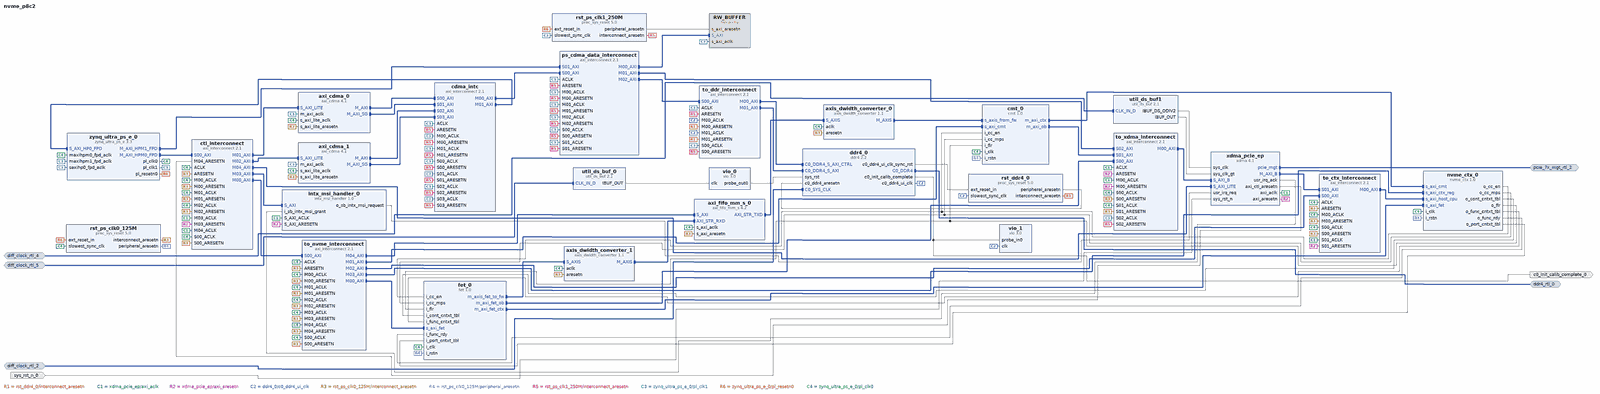
[diagram p0: block diagram of the top level, whole]
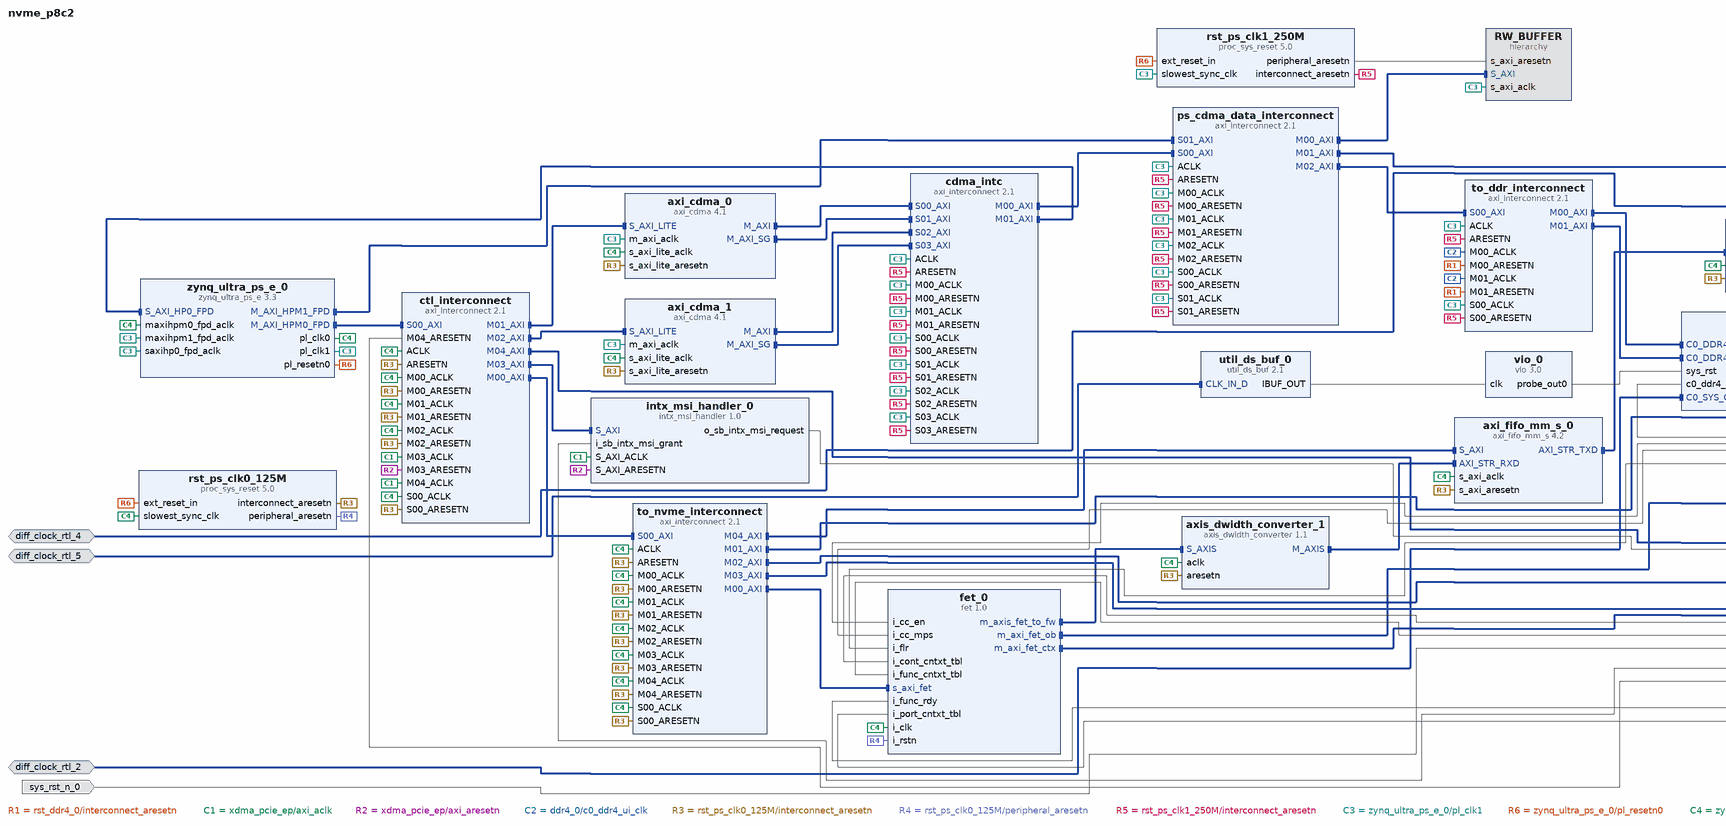
[diagram p1: block diagram of the top level, left part]
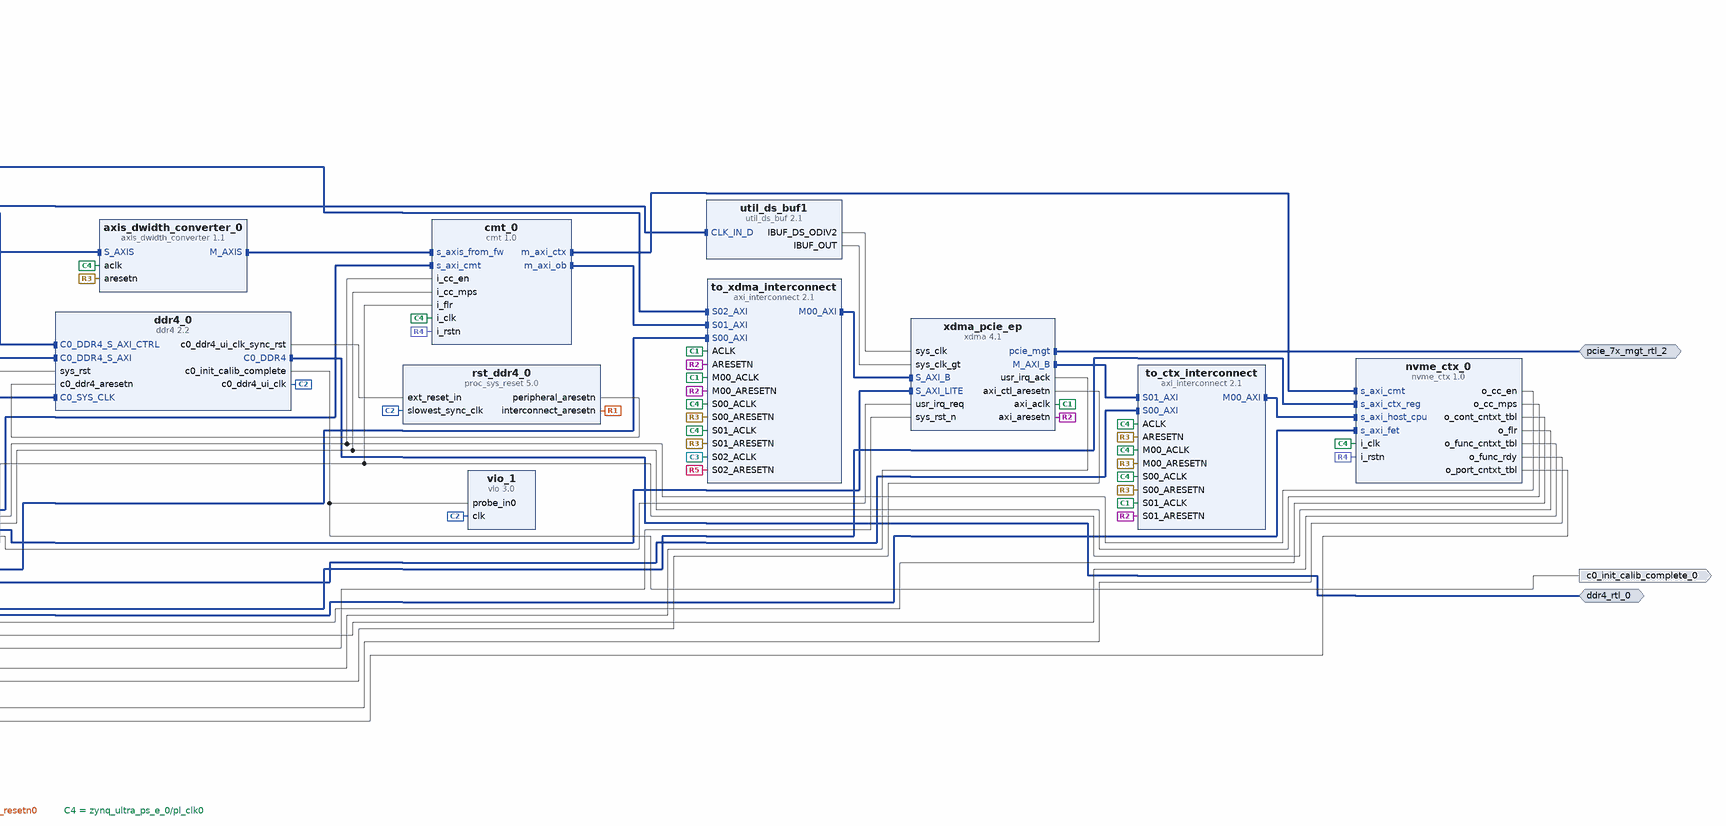
[diagram p2: block diagram of the top level, right part]
# Vivado block design nvme_p8c2, xczu17eg-ffvc1760-2-e, Vivado 2019.1
create_bd_design nvme_p8c2

create_bd_intf_port -mode Master -vlnv xilinx.com:interface:ddr4_rtl:1.0 ddr4_rtl_0
create_bd_intf_port -mode Slave -vlnv xilinx.com:interface:diff_clock_rtl:1.0 diff_clock_rtl_2
set_property -dict {CONFIG.FREQ_HZ 300000000} [get_bd_intf_ports diff_clock_rtl_2]
create_bd_intf_port -mode Slave -vlnv xilinx.com:interface:diff_clock_rtl:1.0 diff_clock_rtl_4
create_bd_intf_port -mode Slave -vlnv xilinx.com:interface:diff_clock_rtl:1.0 diff_clock_rtl_5
create_bd_intf_port -mode Master -vlnv xilinx.com:interface:pcie_7x_mgt_rtl:1.0 pcie_7x_mgt_rtl_2
create_bd_port -dir O c0_init_calib_complete_0
create_bd_port -dir I -type rst sys_rst_n_0

create_bd_cell -type hier RW_BUFFER
create_bd_cell -type ip -vlnv xilinx.com:ip:axi_cdma:4.1 axi_cdma_0
set_property -dict [list \
  CONFIG.C_ADDR_WIDTH 64 \
  CONFIG.C_INCLUDE_SF 1 \
  CONFIG.C_INCLUDE_SG 1 \
  CONFIG.C_M_AXI_DATA_WIDTH 256 \
  CONFIG.C_M_AXI_MAX_BURST_LEN 128 \
] [get_bd_cells axi_cdma_0]
create_bd_cell -type ip -vlnv xilinx.com:ip:axi_fifo_mm_s:4.2 axi_fifo_mm_s_0
set_property -dict [list \
  CONFIG.C_AXIS_TDEST_WIDTH 1 \
  CONFIG.C_HAS_AXIS_TDEST true \
  CONFIG.C_USE_TX_CTRL 0 \
] [get_bd_cells axi_fifo_mm_s_0]
create_bd_cell -type ip -vlnv xilinx.com:ip:axis_dwidth_converter:1.1 axis_dwidth_converter_0
set_property -dict {CONFIG.M_TDATA_NUM_BYTES 16 CONFIG.S_TDATA_NUM_BYTES 4} [get_bd_cells axis_dwidth_converter_0]
create_bd_cell -type ip -vlnv xilinx.com:ip:axis_dwidth_converter:1.1 axis_dwidth_converter_1
set_property -dict {CONFIG.M_TDATA_NUM_BYTES 4 CONFIG.S_TDATA_NUM_BYTES 64} [get_bd_cells axis_dwidth_converter_1]
create_bd_cell -type ip -vlnv xilinx.com:ip:axi_interconnect:2.1 cdma_intc
set_property -dict [list \
  CONFIG.ENABLE_ADVANCED_OPTIONS 1 \
  CONFIG.M00_HAS_DATA_FIFO 0 \
  CONFIG.M00_HAS_REGSLICE 3 \
  CONFIG.M01_HAS_DATA_FIFO 0 \
  CONFIG.M01_HAS_REGSLICE 3 \
  CONFIG.NUM_MI 2 \
  CONFIG.NUM_SI 4 \
  CONFIG.S00_HAS_DATA_FIFO 0 \
  CONFIG.S01_HAS_DATA_FIFO 0 \
  CONFIG.S02_HAS_DATA_FIFO 0 \
  CONFIG.S03_HAS_DATA_FIFO 0 \
  CONFIG.STRATEGY 0 \
  CONFIG.XBAR_DATA_WIDTH 256 \
] [get_bd_cells cdma_intc]
create_bd_cell -type ip -vlnv xilinx.com:user:cmt:1.0 cmt_0
create_bd_cell -type ip -vlnv xilinx.com:ip:ddr4:2.2 ddr4_0
set_property -dict [list \
  CONFIG.C0.CKE_WIDTH 4 \
  CONFIG.C0.CK_WIDTH 2 \
  CONFIG.C0.CS_WIDTH 4 \
  CONFIG.C0.DDR4_AxiAddressWidth 36 \
  CONFIG.C0.DDR4_AxiDataWidth 512 \
  CONFIG.C0.DDR4_CasLatency 12 \
  CONFIG.C0.DDR4_CasWriteLatency 11 \
  CONFIG.C0.DDR4_DataWidth 72 \
  CONFIG.C0.DDR4_InputClockPeriod 3334 \
  CONFIG.C0.DDR4_MemoryPart MTA36ASF4G72PZ-2G3 \
  CONFIG.C0.DDR4_MemoryType RDIMMs \
  CONFIG.C0.DDR4_Slot Dual \
  CONFIG.C0.DDR4_TimePeriod 1250 \
  CONFIG.C0.ODT_WIDTH 4 \
] [get_bd_cells ddr4_0]
create_bd_cell -type ip -vlnv xilinx.com:user:fet:1.0 fet_0
create_bd_cell -type ip -vlnv xilinx.com:user:intx_msi_handler:1.0 intx_msi_handler_0
create_bd_cell -type ip -vlnv xilinx.com:user:nvme_ctx:1.0 nvme_ctx_0
create_bd_cell -type ip -vlnv xilinx.com:ip:axi_interconnect:2.1 ps_cdma_data_interconnect
set_property -dict [list \
  CONFIG.ENABLE_ADVANCED_OPTIONS 1 \
  CONFIG.M00_HAS_DATA_FIFO 0 \
  CONFIG.M00_HAS_REGSLICE 0 \
  CONFIG.M01_HAS_REGSLICE 0 \
  CONFIG.M02_HAS_DATA_FIFO 0 \
  CONFIG.M02_HAS_REGSLICE 0 \
  CONFIG.M04_HAS_REGSLICE 0 \
  CONFIG.NUM_MI 3 \
  CONFIG.NUM_SI 2 \
  CONFIG.S00_HAS_DATA_FIFO 0 \
  CONFIG.S00_HAS_REGSLICE 0 \
  CONFIG.S01_HAS_DATA_FIFO 0 \
  CONFIG.S01_HAS_REGSLICE 0 \
  CONFIG.STRATEGY 0 \
  CONFIG.XBAR_DATA_WIDTH 256 \
] [get_bd_cells ps_cdma_data_interconnect]
create_bd_cell -type ip -vlnv xilinx.com:ip:proc_sys_reset:5.0 rst_ddr4_0
create_bd_cell -type ip -vlnv xilinx.com:ip:proc_sys_reset:5.0 rst_ps_clk1_250M
create_bd_cell -type ip -vlnv xilinx.com:ip:proc_sys_reset:5.0 rst_ps_clk0_125M
create_bd_cell -type ip -vlnv xilinx.com:ip:axi_interconnect:2.1 to_ctx_interconnect
set_property -dict [list \
  CONFIG.NUM_MI 1 \
  CONFIG.NUM_SI 2 \
  CONFIG.S00_HAS_DATA_FIFO 0 \
  CONFIG.S01_HAS_DATA_FIFO 0 \
  CONFIG.STRATEGY 0 \
] [get_bd_cells to_ctx_interconnect]
create_bd_cell -type ip -vlnv xilinx.com:ip:axi_interconnect:2.1 to_ddr_interconnect
set_property -dict [list \
  CONFIG.ENABLE_ADVANCED_OPTIONS 1 \
  CONFIG.M00_HAS_DATA_FIFO 0 \
  CONFIG.M00_HAS_REGSLICE 3 \
  CONFIG.M01_HAS_DATA_FIFO 0 \
  CONFIG.M01_HAS_REGSLICE 3 \
  CONFIG.M02_HAS_DATA_FIFO 0 \
  CONFIG.M02_HAS_REGSLICE 3 \
  CONFIG.M03_HAS_DATA_FIFO 0 \
  CONFIG.M03_HAS_REGSLICE 3 \
  CONFIG.NUM_MI 2 \
  CONFIG.NUM_SI 1 \
  CONFIG.S00_HAS_DATA_FIFO 0 \
  CONFIG.S00_HAS_REGSLICE 3 \
  CONFIG.STRATEGY 0 \
  CONFIG.XBAR_DATA_WIDTH 256 \
] [get_bd_cells to_ddr_interconnect]
create_bd_cell -type ip -vlnv xilinx.com:ip:axi_interconnect:2.1 to_nvme_interconnect
set_property -dict [list \
  CONFIG.ENABLE_ADVANCED_OPTIONS 1 \
  CONFIG.NUM_MI 5 \
  CONFIG.S00_HAS_DATA_FIFO 0 \
  CONFIG.STRATEGY 0 \
] [get_bd_cells to_nvme_interconnect]
create_bd_cell -type ip -vlnv xilinx.com:ip:axi_interconnect:2.1 to_xdma_interconnect
set_property -dict [list \
  CONFIG.ENABLE_ADVANCED_OPTIONS 1 \
  CONFIG.M00_HAS_REGSLICE 3 \
  CONFIG.NUM_MI 1 \
  CONFIG.NUM_SI 3 \
  CONFIG.S00_HAS_DATA_FIFO 0 \
  CONFIG.S01_HAS_DATA_FIFO 0 \
  CONFIG.S02_HAS_DATA_FIFO 0 \
  CONFIG.STRATEGY 0 \
  CONFIG.XBAR_DATA_WIDTH 256 \
] [get_bd_cells to_xdma_interconnect]
create_bd_cell -type ip -vlnv xilinx.com:ip:util_ds_buf:2.1 util_ds_buf1
set_property -dict {CONFIG.C_BUF_TYPE IBUFDSGTE} [get_bd_cells util_ds_buf1]
create_bd_cell -type ip -vlnv xilinx.com:ip:util_ds_buf:2.1 util_ds_buf_0
create_bd_cell -type ip -vlnv xilinx.com:ip:vio:3.0 vio_0
set_property -dict {CONFIG.C_NUM_PROBE_IN 0} [get_bd_cells vio_0]
create_bd_cell -type ip -vlnv xilinx.com:ip:vio:3.0 vio_1
set_property -dict {CONFIG.C_NUM_PROBE_OUT 0} [get_bd_cells vio_1]
create_bd_cell -type ip -vlnv xilinx.com:ip:xdma:4.1 xdma_pcie_ep
set_property -dict [list \
  CONFIG.PF0_DEVICE_ID_mqdma 9038 \
  CONFIG.PF2_DEVICE_ID_mqdma 9038 \
  CONFIG.PF3_DEVICE_ID_mqdma 9038 \
  CONFIG.axi_addr_width 64 \
  CONFIG.axi_data_width 256_bit \
  CONFIG.bar0_indicator 0 \
  CONFIG.c_m_axi_num_write 16 \
  CONFIG.en_dbg_descramble false \
  CONFIG.enable_ibert false \
  CONFIG.enable_jtag_dbg false \
  CONFIG.enable_mark_debug false \
  CONFIG.functional_mode AXI_Bridge \
  CONFIG.mode_selection Advanced \
  CONFIG.pcie_blk_locn X1Y0 \
  CONFIG.pciebar2axibar_0 0x00000004c0000000 \
  CONFIG.pf0_bar0_64bit true \
  CONFIG.pf0_bar0_size 16 \
  CONFIG.pf0_bar2_enabled false \
  CONFIG.pf0_base_class_menu Mass_storage_controller \
  CONFIG.pf0_class_code_base 01 \
  CONFIG.pf0_class_code_interface 02 \
  CONFIG.pf0_class_code_sub 08 \
  CONFIG.pf0_device_id a822 \
  CONFIG.pf0_msi_enabled false \
  CONFIG.pf0_msix_cap_pba_bir BAR_1:0 \
  CONFIG.pf0_msix_cap_pba_offset 3000 \
  CONFIG.pf0_msix_cap_table_bir BAR_1:0 \
  CONFIG.pf0_msix_cap_table_offset 00002000 \
  CONFIG.pf0_msix_cap_table_size 01F \
  CONFIG.pf0_msix_enabled true \
  CONFIG.pf0_msix_impl_locn External \
  CONFIG.pf0_sub_class_interface_menu Other_mass_storage_controller \
  CONFIG.pf0_subsystem_id 1fdf \
  CONFIG.pf0_subsystem_vendor_id 1028 \
  CONFIG.pl_link_cap_max_link_speed 8.0_GT/s \
  CONFIG.pl_link_cap_max_link_width X8 \
  CONFIG.plltype QPLL1 \
  CONFIG.vendor_id 144d \
] [get_bd_cells xdma_pcie_ep]
create_bd_cell -type ip -vlnv xilinx.com:ip:zynq_ultra_ps_e:3.3 zynq_ultra_ps_e_0
set_property -dict [list \
  CONFIG.CAN0_BOARD_INTERFACE custom \
  CONFIG.CAN1_BOARD_INTERFACE custom \
  CONFIG.CSU_BOARD_INTERFACE custom \
  CONFIG.DP_BOARD_INTERFACE custom \
  CONFIG.GEM0_BOARD_INTERFACE custom \
  CONFIG.GEM1_BOARD_INTERFACE custom \
  CONFIG.GEM2_BOARD_INTERFACE custom \
  CONFIG.GEM3_BOARD_INTERFACE custom \
  CONFIG.GPIO_BOARD_INTERFACE custom \
  CONFIG.IIC0_BOARD_INTERFACE custom \
  CONFIG.IIC1_BOARD_INTERFACE custom \
  CONFIG.NAND_BOARD_INTERFACE custom \
  CONFIG.PCIE_BOARD_INTERFACE custom \
  CONFIG.PJTAG_BOARD_INTERFACE custom \
  CONFIG.PMU_BOARD_INTERFACE custom \
  CONFIG.PSU_BANK_0_IO_STANDARD LVCMOS18 \
  CONFIG.PSU_BANK_1_IO_STANDARD LVCMOS18 \
  CONFIG.PSU_BANK_2_IO_STANDARD LVCMOS18 \
  CONFIG.PSU_BANK_3_IO_STANDARD LVCMOS33 \
  CONFIG.PSU_USB3__DUAL_CLOCK_ENABLE 0 \
  CONFIG.PSU__CAN1__PERIPHERAL__ENABLE 0 \
  CONFIG.PSU__CRF_APB__ACPU_CTRL__FREQMHZ 1333.333 \
  CONFIG.PSU__CRF_APB__ACPU_CTRL__SRCSEL APLL \
  CONFIG.PSU__CRF_APB__APLL_CTRL__SRCSEL PSS_REF_CLK \
  CONFIG.PSU__CRF_APB__DBG_FPD_CTRL__FREQMHZ 250 \
  CONFIG.PSU__CRF_APB__DBG_FPD_CTRL__SRCSEL IOPLL \
  CONFIG.PSU__CRF_APB__DBG_TRACE_CTRL__FREQMHZ 250 \
  CONFIG.PSU__CRF_APB__DBG_TRACE_CTRL__SRCSEL IOPLL \
  CONFIG.PSU__CRF_APB__DBG_TSTMP_CTRL__FREQMHZ 250 \
  CONFIG.PSU__CRF_APB__DBG_TSTMP_CTRL__SRCSEL IOPLL \
  CONFIG.PSU__CRF_APB__DDR_CTRL__FREQMHZ 1200 \
  CONFIG.PSU__CRF_APB__DDR_CTRL__SRCSEL DPLL \
  CONFIG.PSU__CRF_APB__DPDMA_REF_CTRL__FREQMHZ 600 \
  CONFIG.PSU__CRF_APB__DPDMA_REF_CTRL__SRCSEL DPLL \
  CONFIG.PSU__CRF_APB__DPLL_CTRL__SRCSEL PSS_REF_CLK \
  CONFIG.PSU__CRF_APB__DP_AUDIO_REF_CTRL__SRCSEL VPLL \
  CONFIG.PSU__CRF_APB__DP_STC_REF_CTRL__SRCSEL VPLL \
  CONFIG.PSU__CRF_APB__DP_VIDEO_REF_CTRL__SRCSEL DPLL \
  CONFIG.PSU__CRF_APB__GDMA_REF_CTRL__FREQMHZ 600 \
  CONFIG.PSU__CRF_APB__GDMA_REF_CTRL__SRCSEL DPLL \
  CONFIG.PSU__CRF_APB__GPU_REF_CTRL__FREQMHZ 600 \
  CONFIG.PSU__CRF_APB__GPU_REF_CTRL__SRCSEL DPLL \
  CONFIG.PSU__CRF_APB__TOPSW_LSBUS_CTRL__FREQMHZ 100 \
  CONFIG.PSU__CRF_APB__TOPSW_LSBUS_CTRL__SRCSEL IOPLL \
  CONFIG.PSU__CRF_APB__TOPSW_MAIN_CTRL__FREQMHZ 533.333 \
  CONFIG.PSU__CRF_APB__TOPSW_MAIN_CTRL__SRCSEL VPLL \
  CONFIG.PSU__CRF_APB__VPLL_CTRL__SRCSEL PSS_REF_CLK \
  CONFIG.PSU__CRL_APB__ADMA_REF_CTRL__FREQMHZ 533.333 \
  CONFIG.PSU__CRL_APB__ADMA_REF_CTRL__SRCSEL RPLL \
  CONFIG.PSU__CRL_APB__CAN1_REF_CTRL__FREQMHZ 100 \
  CONFIG.PSU__CRL_APB__CAN1_REF_CTRL__SRCSEL IOPLL \
  CONFIG.PSU__CRL_APB__CPU_R5_CTRL__FREQMHZ 533.333 \
  CONFIG.PSU__CRL_APB__CPU_R5_CTRL__SRCSEL RPLL \
  CONFIG.PSU__CRL_APB__DBG_LPD_CTRL__FREQMHZ 250 \
  CONFIG.PSU__CRL_APB__DBG_LPD_CTRL__SRCSEL IOPLL \
  CONFIG.PSU__CRL_APB__GEM3_REF_CTRL__FREQMHZ 125 \
  CONFIG.PSU__CRL_APB__GEM3_REF_CTRL__SRCSEL IOPLL \
  CONFIG.PSU__CRL_APB__I2C0_REF_CTRL__FREQMHZ 100 \
  CONFIG.PSU__CRL_APB__I2C0_REF_CTRL__SRCSEL IOPLL \
  CONFIG.PSU__CRL_APB__I2C1_REF_CTRL__FREQMHZ 100 \
  CONFIG.PSU__CRL_APB__I2C1_REF_CTRL__SRCSEL IOPLL \
  CONFIG.PSU__CRL_APB__IOPLL_CTRL__SRCSEL PSS_REF_CLK \
  CONFIG.PSU__CRL_APB__IOU_SWITCH_CTRL__FREQMHZ 267 \
  CONFIG.PSU__CRL_APB__IOU_SWITCH_CTRL__SRCSEL RPLL \
  CONFIG.PSU__CRL_APB__LPD_LSBUS_CTRL__FREQMHZ 100 \
  CONFIG.PSU__CRL_APB__LPD_LSBUS_CTRL__SRCSEL IOPLL \
  CONFIG.PSU__CRL_APB__LPD_SWITCH_CTRL__FREQMHZ 533.333 \
  CONFIG.PSU__CRL_APB__LPD_SWITCH_CTRL__SRCSEL RPLL \
  CONFIG.PSU__CRL_APB__PCAP_CTRL__FREQMHZ 200 \
  CONFIG.PSU__CRL_APB__PCAP_CTRL__SRCSEL IOPLL \
  CONFIG.PSU__CRL_APB__PL0_REF_CTRL__FREQMHZ 125 \
  CONFIG.PSU__CRL_APB__PL0_REF_CTRL__SRCSEL IOPLL \
  CONFIG.PSU__CRL_APB__PL1_REF_CTRL__FREQMHZ 250 \
  CONFIG.PSU__CRL_APB__PL1_REF_CTRL__SRCSEL IOPLL \
  CONFIG.PSU__CRL_APB__QSPI_REF_CTRL__FREQMHZ 300 \
  CONFIG.PSU__CRL_APB__QSPI_REF_CTRL__SRCSEL IOPLL \
  CONFIG.PSU__CRL_APB__RPLL_CTRL__SRCSEL PSS_REF_CLK \
  CONFIG.PSU__CRL_APB__SDIO1_REF_CTRL__FREQMHZ 50 \
  CONFIG.PSU__CRL_APB__SDIO1_REF_CTRL__SRCSEL IOPLL \
  CONFIG.PSU__CRL_APB__TIMESTAMP_REF_CTRL__FREQMHZ 100 \
  CONFIG.PSU__CRL_APB__TIMESTAMP_REF_CTRL__SRCSEL PSS_REF_CLK \
  CONFIG.PSU__CRL_APB__UART0_REF_CTRL__FREQMHZ 100 \
  CONFIG.PSU__CRL_APB__UART0_REF_CTRL__SRCSEL IOPLL \
  CONFIG.PSU__CRL_APB__UART1_REF_CTRL__FREQMHZ 100 \
  CONFIG.PSU__CRL_APB__UART1_REF_CTRL__SRCSEL IOPLL \
  CONFIG.PSU__CRL_APB__USB0_BUS_REF_CTRL__FREQMHZ 250 \
  CONFIG.PSU__CRL_APB__USB0_BUS_REF_CTRL__SRCSEL IOPLL \
  CONFIG.PSU__CRL_APB__USB3_DUAL_REF_CTRL__FREQMHZ 20 \
  CONFIG.PSU__CRL_APB__USB3_DUAL_REF_CTRL__SRCSEL IOPLL \
  CONFIG.PSU__CRL_APB__USB3__ENABLE 0 \
  CONFIG.PSU__CSUPMU__PERIPHERAL__VALID 1 \
  CONFIG.PSU__DDRC__BUS_WIDTH {32 Bit} \
  CONFIG.PSU__DDRC__DEVICE_CAPACITY {16384 MBits} \
  CONFIG.PSU__DDRC__DRAM_WIDTH {32 Bits} \
  CONFIG.PSU__DDRC__ECC Disabled \
  CONFIG.PSU__DDRC__MEMORY_TYPE {LPDDR 4} \
  CONFIG.PSU__DDRC__SPEED_BIN LPDDR4_2400 \
  CONFIG.PSU__DDR_HIGH_ADDRESS_GUI_ENABLE 0 \
  CONFIG.PSU__DDR__INTERFACE__FREQMHZ 600.000 \
  CONFIG.PSU__DEVICE_TYPE EG \
  CONFIG.PSU__DISPLAYPORT__PERIPHERAL__ENABLE 0 \
  CONFIG.PSU__DLL__ISUSED 1 \
  CONFIG.PSU__ENET3__FIFO__ENABLE 0 \
  CONFIG.PSU__ENET3__GRP_MDIO__ENABLE 1 \
  CONFIG.PSU__ENET3__GRP_MDIO__IO {MIO 76 .. 77} \
  CONFIG.PSU__ENET3__PERIPHERAL__ENABLE 1 \
  CONFIG.PSU__ENET3__PERIPHERAL__IO {MIO 64 .. 75} \
  CONFIG.PSU__ENET3__PTP__ENABLE 0 \
  CONFIG.PSU__ENET3__TSU__ENABLE 0 \
  CONFIG.PSU__EXPAND__FPD_SLAVES 1 \
  CONFIG.PSU__FPGA_PL0_ENABLE 1 \
  CONFIG.PSU__FPGA_PL1_ENABLE 1 \
  CONFIG.PSU__GEM3_COHERENCY 0 \
  CONFIG.PSU__GEM3_ROUTE_THROUGH_FPD 0 \
  CONFIG.PSU__GEM__TSU__ENABLE 0 \
  CONFIG.PSU__GPIO0_MIO__IO {MIO 0 .. 25} \
  CONFIG.PSU__GPIO0_MIO__PERIPHERAL__ENABLE 1 \
  CONFIG.PSU__GPIO1_MIO__IO {MIO 26 .. 51} \
  CONFIG.PSU__GPIO1_MIO__PERIPHERAL__ENABLE 1 \
  CONFIG.PSU__I2C0__PERIPHERAL__ENABLE 1 \
  CONFIG.PSU__I2C0__PERIPHERAL__IO {MIO 14 .. 15} \
  CONFIG.PSU__I2C1__PERIPHERAL__ENABLE 1 \
  CONFIG.PSU__I2C1__PERIPHERAL__IO {MIO 16 .. 17} \
  CONFIG.PSU__IOU_SLCR__IOU_TTC_APB_CLK__TTC0_SEL APB \
  CONFIG.PSU__IOU_SLCR__IOU_TTC_APB_CLK__TTC1_SEL APB \
  CONFIG.PSU__IOU_SLCR__IOU_TTC_APB_CLK__TTC2_SEL APB \
  CONFIG.PSU__IOU_SLCR__IOU_TTC_APB_CLK__TTC3_SEL APB \
  CONFIG.PSU__MAXIGP0__DATA_WIDTH 32 \
  CONFIG.PSU__OVERRIDE_HPX_QOS 0 \
  CONFIG.PSU__OVERRIDE__BASIC_CLOCK 0 \
  CONFIG.PSU__PMU_COHERENCY 0 \
  CONFIG.PSU__PMU__AIBACK__ENABLE 0 \
  CONFIG.PSU__PMU__EMIO_GPI__ENABLE 0 \
  CONFIG.PSU__PMU__EMIO_GPO__ENABLE 0 \
  CONFIG.PSU__PMU__GPI0__ENABLE 0 \
  CONFIG.PSU__PMU__GPI1__ENABLE 0 \
  CONFIG.PSU__PMU__GPI2__ENABLE 0 \
  CONFIG.PSU__PMU__GPI3__ENABLE 0 \
  CONFIG.PSU__PMU__GPI4__ENABLE 0 \
  CONFIG.PSU__PMU__GPI5__ENABLE 0 \
  CONFIG.PSU__PMU__GPO0__ENABLE 0 \
  CONFIG.PSU__PMU__GPO1__ENABLE 0 \
  CONFIG.PSU__PMU__GPO2__ENABLE 0 \
  CONFIG.PSU__PMU__GPO3__ENABLE 0 \
  CONFIG.PSU__PMU__GPO4__ENABLE 0 \
  CONFIG.PSU__PMU__GPO5__ENABLE 0 \
  CONFIG.PSU__PMU__PERIPHERAL__ENABLE 1 \
  CONFIG.PSU__PMU__PLERROR__ENABLE 0 \
  CONFIG.PSU__PRESET_APPLIED 0 \
  CONFIG.PSU__PSS_REF_CLK__FREQMHZ 33.333 \
  CONFIG.PSU__QSPI_COHERENCY 0 \
  CONFIG.PSU__QSPI_ROUTE_THROUGH_FPD 0 \
  CONFIG.PSU__QSPI__GRP_FBCLK__ENABLE 0 \
  CONFIG.PSU__QSPI__PERIPHERAL__DATA_MODE x4 \
  CONFIG.PSU__QSPI__PERIPHERAL__ENABLE 1 \
  CONFIG.PSU__QSPI__PERIPHERAL__IO {MIO 0 .. 12} \
  CONFIG.PSU__QSPI__PERIPHERAL__MODE {Dual Parallel} \
  CONFIG.PSU__SATA__PERIPHERAL__ENABLE 0 \
  CONFIG.PSU__SD1_COHERENCY 0 \
  CONFIG.PSU__SD1_ROUTE_THROUGH_FPD 0 \
  CONFIG.PSU__SD1__DATA_TRANSFER_MODE 4Bit \
  CONFIG.PSU__SD1__GRP_CD__ENABLE 1 \
  CONFIG.PSU__SD1__GRP_CD__IO {MIO 45} \
  CONFIG.PSU__SD1__GRP_POW__ENABLE 0 \
  CONFIG.PSU__SD1__GRP_WP__ENABLE 0 \
  CONFIG.PSU__SD1__PERIPHERAL__ENABLE 1 \
  CONFIG.PSU__SD1__PERIPHERAL__IO {MIO 46 .. 51} \
  CONFIG.PSU__SD1__SLOT_TYPE {SD 2.0} \
  CONFIG.PSU__SWDT0__CLOCK__ENABLE 0 \
  CONFIG.PSU__SWDT0__PERIPHERAL__ENABLE 1 \
  CONFIG.PSU__SWDT0__RESET__ENABLE 0 \
  CONFIG.PSU__SWDT1__CLOCK__ENABLE 0 \
  CONFIG.PSU__SWDT1__PERIPHERAL__ENABLE 1 \
  CONFIG.PSU__SWDT1__RESET__ENABLE 0 \
  CONFIG.PSU__TSU__BUFG_PORT_PAIR 0 \
  CONFIG.PSU__TTC0__CLOCK__ENABLE 0 \
  CONFIG.PSU__TTC0__PERIPHERAL__ENABLE 1 \
  CONFIG.PSU__TTC0__WAVEOUT__ENABLE 0 \
  CONFIG.PSU__TTC1__CLOCK__ENABLE 0 \
  CONFIG.PSU__TTC1__PERIPHERAL__ENABLE 1 \
  CONFIG.PSU__TTC1__WAVEOUT__ENABLE 0 \
  CONFIG.PSU__TTC2__CLOCK__ENABLE 0 \
  CONFIG.PSU__TTC2__PERIPHERAL__ENABLE 1 \
  CONFIG.PSU__TTC2__WAVEOUT__ENABLE 0 \
  CONFIG.PSU__TTC3__CLOCK__ENABLE 0 \
  CONFIG.PSU__TTC3__PERIPHERAL__ENABLE 1 \
  CONFIG.PSU__TTC3__WAVEOUT__ENABLE 0 \
  CONFIG.PSU__UART0__BAUD_RATE 115200 \
  CONFIG.PSU__UART0__MODEM__ENABLE 0 \
  CONFIG.PSU__UART0__PERIPHERAL__ENABLE 1 \
  CONFIG.PSU__UART0__PERIPHERAL__IO {MIO 18 .. 19} \
  CONFIG.PSU__UART1__BAUD_RATE 115200 \
  CONFIG.PSU__UART1__MODEM__ENABLE 0 \
  CONFIG.PSU__UART1__PERIPHERAL__ENABLE 1 \
  CONFIG.PSU__UART1__PERIPHERAL__IO {MIO 20 .. 21} \
  CONFIG.PSU__USB0__PERIPHERAL__ENABLE 0 \
  CONFIG.PSU__USE__IRQ0 0 \
  CONFIG.PSU__USE__M_AXI_GP0 1 \
  CONFIG.PSU__USE__M_AXI_GP1 1 \
  CONFIG.PSU__USE__M_AXI_GP2 0 \
  CONFIG.PSU__USE__S_AXI_GP2 1 \
  CONFIG.QSPI_BOARD_INTERFACE custom \
  CONFIG.SATA_BOARD_INTERFACE custom \
  CONFIG.SD0_BOARD_INTERFACE custom \
  CONFIG.SD1_BOARD_INTERFACE custom \
  CONFIG.SPI0_BOARD_INTERFACE custom \
  CONFIG.SPI1_BOARD_INTERFACE custom \
  CONFIG.SUBPRESET1 Custom \
  CONFIG.SUBPRESET2 Custom \
  CONFIG.SWDT0_BOARD_INTERFACE custom \
  CONFIG.SWDT1_BOARD_INTERFACE custom \
  CONFIG.TRACE_BOARD_INTERFACE custom \
  CONFIG.TTC0_BOARD_INTERFACE custom \
  CONFIG.TTC1_BOARD_INTERFACE custom \
  CONFIG.TTC2_BOARD_INTERFACE custom \
  CONFIG.TTC3_BOARD_INTERFACE custom \
  CONFIG.UART0_BOARD_INTERFACE custom \
  CONFIG.UART1_BOARD_INTERFACE custom \
  CONFIG.USB0_BOARD_INTERFACE custom \
  CONFIG.USB1_BOARD_INTERFACE custom \
] [get_bd_cells zynq_ultra_ps_e_0]
# 770 more settings of zynq_ultra_ps_e_0 are not shown: defaults, MIO pin electricals, DDR timing, and values the tool derives
create_bd_cell -type ip -vlnv xilinx.com:ip:axi_cdma:4.1 axi_cdma_1
set_property -dict [list \
  CONFIG.C_ADDR_WIDTH 64 \
  CONFIG.C_INCLUDE_SF 1 \
  CONFIG.C_M_AXI_DATA_WIDTH 256 \
  CONFIG.C_M_AXI_MAX_BURST_LEN 128 \
] [get_bd_cells axi_cdma_1]
create_bd_cell -type ip -vlnv xilinx.com:ip:axi_interconnect:2.1 ctl_interconnect
set_property -dict {CONFIG.NUM_MI 5} [get_bd_cells ctl_interconnect]

# ---- hierarchy /RW_BUFFER ----
current_bd_instance /RW_BUFFER
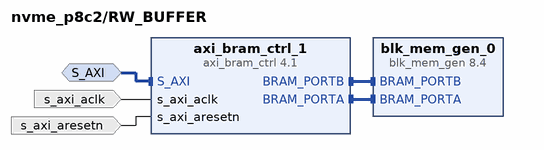
[diagram p3: block diagram inside /RW_BUFFER]
create_bd_intf_pin -mode Slave -vlnv xilinx.com:interface:aximm_rtl:1.0 S_AXI
create_bd_pin -dir I -type clk s_axi_aclk
create_bd_pin -dir I -type rst s_axi_aresetn

create_bd_cell -type ip -vlnv xilinx.com:ip:axi_bram_ctrl:4.1 axi_bram_ctrl_1
set_property -dict {CONFIG.DATA_WIDTH 256 CONFIG.RD_CMD_OPTIMIZATION 1} [get_bd_cells axi_bram_ctrl_1]
create_bd_cell -type ip -vlnv xilinx.com:ip:blk_mem_gen:8.4 blk_mem_gen_0
set_property -dict [list \
  CONFIG.Assume_Synchronous_Clk false \
  CONFIG.EN_SAFETY_CKT true \
  CONFIG.Enable_32bit_Address true \
  CONFIG.Enable_B Use_ENB_Pin \
  CONFIG.Memory_Type True_Dual_Port_RAM \
  CONFIG.Operating_Mode_A WRITE_FIRST \
  CONFIG.Operating_Mode_B WRITE_FIRST \
  CONFIG.PRIM_type_to_Implement BRAM \
  CONFIG.Port_B_Clock 100 \
  CONFIG.Port_B_Enable_Rate 100 \
  CONFIG.Port_B_Write_Rate 50 \
  CONFIG.Register_PortA_Output_of_Memory_Primitives false \
  CONFIG.Register_PortB_Output_of_Memory_Primitives false \
  CONFIG.Use_RSTA_Pin true \
  CONFIG.Use_RSTB_Pin true \
  CONFIG.use_bram_block BRAM_Controller \
] [get_bd_cells blk_mem_gen_0]

# ---- connections ----

current_bd_instance /RW_BUFFER
connect_bd_intf_net [get_bd_intf_pins axi_bram_ctrl_1/BRAM_PORTB] [get_bd_intf_pins blk_mem_gen_0/BRAM_PORTB]
connect_bd_intf_net [get_bd_intf_pins axi_bram_ctrl_1/BRAM_PORTA] [get_bd_intf_pins blk_mem_gen_0/BRAM_PORTA]
connect_bd_intf_net -intf_net axi_interconnect_4_M00_AXI [get_bd_intf_pins S_AXI] [get_bd_intf_pins axi_bram_ctrl_1/S_AXI]
connect_bd_net -net zynq_ultra_ps_e_0_pl_clk1 [get_bd_pins s_axi_aclk] [get_bd_pins axi_bram_ctrl_1/s_axi_aclk]
connect_bd_net -net proc_sys_reset_2_peripheral_aresetn [get_bd_pins s_axi_aresetn] [get_bd_pins axi_bram_ctrl_1/s_axi_aresetn]

current_bd_instance /
connect_bd_intf_net -intf_net axi_interconnect_4_M00_AXI1 [get_bd_intf_pins to_ctx_interconnect/M00_AXI] [get_bd_intf_pins nvme_ctx_0/s_axi_host_cpu]
connect_bd_intf_net [get_bd_intf_pins ctl_interconnect/S00_AXI] [get_bd_intf_pins zynq_ultra_ps_e_0/M_AXI_HPM0_FPD]
connect_bd_intf_net -intf_net axi_interconnect_0_M01_AXI [get_bd_intf_pins cdma_intc/M01_AXI] [get_bd_intf_pins zynq_ultra_ps_e_0/S_AXI_HP0_FPD]
connect_bd_intf_net -intf_net CLK_IN_D_0_1 [get_bd_intf_ports diff_clock_rtl_4] [get_bd_intf_pins util_ds_buf1/CLK_IN_D]
connect_bd_intf_net [get_bd_intf_pins to_ddr_interconnect/M00_AXI] [get_bd_intf_pins ddr4_0/C0_DDR4_S_AXI_CTRL]
connect_bd_intf_net -intf_net ps_ctl_interconnect_M04_AXI [get_bd_intf_pins xdma_pcie_ep/S_AXI_LITE] [get_bd_intf_pins ctl_interconnect/M04_AXI]
connect_bd_intf_net [get_bd_intf_pins cmt_0/m_axi_ob] [get_bd_intf_pins to_xdma_interconnect/S01_AXI]
connect_bd_intf_net [get_bd_intf_pins zynq_ultra_ps_e_0/M_AXI_HPM1_FPD] [get_bd_intf_pins ps_cdma_data_interconnect/S01_AXI]
connect_bd_intf_net -intf_net ps_ctl_interconnect_M02_AXI [get_bd_intf_pins ctl_interconnect/M02_AXI] [get_bd_intf_pins axi_cdma_1/S_AXI_LITE]
connect_bd_intf_net [get_bd_intf_ports ddr4_rtl_0] [get_bd_intf_pins ddr4_0/C0_DDR4]
connect_bd_intf_net [get_bd_intf_pins to_xdma_interconnect/S02_AXI] [get_bd_intf_pins ps_cdma_data_interconnect/M01_AXI]
connect_bd_intf_net [get_bd_intf_pins axi_fifo_mm_s_0/AXI_STR_TXD] [get_bd_intf_pins axis_dwidth_converter_0/S_AXIS]
connect_bd_intf_net [get_bd_intf_pins to_ctx_interconnect/S01_AXI] [get_bd_intf_pins xdma_pcie_ep/M_AXI_B]
connect_bd_intf_net [get_bd_intf_pins fet_0/m_axi_fet_ob] [get_bd_intf_pins to_xdma_interconnect/S00_AXI]
connect_bd_intf_net [get_bd_intf_pins cmt_0/m_axi_ctx] [get_bd_intf_pins nvme_ctx_0/s_axi_cmt]
connect_bd_intf_net [get_bd_intf_pins to_nvme_interconnect/S00_AXI] [get_bd_intf_pins ctl_interconnect/M00_AXI]
connect_bd_intf_net [get_bd_intf_pins axi_cdma_1/M_AXI] [get_bd_intf_pins cdma_intc/S02_AXI]
connect_bd_intf_net [get_bd_intf_pins to_nvme_interconnect/M02_AXI] [get_bd_intf_pins to_ctx_interconnect/S00_AXI]
connect_bd_intf_net [get_bd_intf_pins axi_cdma_0/M_AXI] [get_bd_intf_pins cdma_intc/S00_AXI]
connect_bd_intf_net -intf_net CLK_IN_D_0_2 [get_bd_intf_ports diff_clock_rtl_5] [get_bd_intf_pins util_ds_buf_0/CLK_IN_D]
connect_bd_intf_net [get_bd_intf_pins cmt_0/s_axi_cmt] [get_bd_intf_pins to_nvme_interconnect/M01_AXI]
connect_bd_intf_net -intf_net ps_ctl_interconnect_M01_AXI [get_bd_intf_pins ctl_interconnect/M01_AXI] [get_bd_intf_pins axi_cdma_0/S_AXI_LITE]
connect_bd_intf_net [get_bd_intf_pins to_nvme_interconnect/M04_AXI] [get_bd_intf_pins axi_fifo_mm_s_0/S_AXI]
connect_bd_intf_net -intf_net axi_interconnect_4_M00_AXI [get_bd_intf_pins ps_cdma_data_interconnect/M00_AXI] [get_bd_intf_pins RW_BUFFER/S_AXI]
connect_bd_intf_net -intf_net diff_clock_rtl_2_1 [get_bd_intf_ports diff_clock_rtl_2] [get_bd_intf_pins ddr4_0/C0_SYS_CLK]
connect_bd_intf_net [get_bd_intf_pins to_nvme_interconnect/M03_AXI] [get_bd_intf_pins nvme_ctx_0/s_axi_ctx_reg]
connect_bd_intf_net -intf_net xdma_2_pcie_mgt [get_bd_intf_ports pcie_7x_mgt_rtl_2] [get_bd_intf_pins xdma_pcie_ep/pcie_mgt]
connect_bd_intf_net [get_bd_intf_pins fet_0/m_axis_fet_to_fw] [get_bd_intf_pins axis_dwidth_converter_1/S_AXIS]
connect_bd_intf_net [get_bd_intf_pins axi_cdma_0/M_AXI_SG] [get_bd_intf_pins cdma_intc/S01_AXI]
connect_bd_intf_net -intf_net axi_interconnect_0_M00_AXI [get_bd_intf_pins cdma_intc/M00_AXI] [get_bd_intf_pins ps_cdma_data_interconnect/S00_AXI]
connect_bd_intf_net [get_bd_intf_pins axi_cdma_1/M_AXI_SG] [get_bd_intf_pins cdma_intc/S03_AXI]
connect_bd_intf_net [get_bd_intf_pins axis_dwidth_converter_1/M_AXIS] [get_bd_intf_pins axi_fifo_mm_s_0/AXI_STR_RXD]
connect_bd_intf_net [get_bd_intf_pins to_xdma_interconnect/M00_AXI] [get_bd_intf_pins xdma_pcie_ep/S_AXI_B]
connect_bd_intf_net -intf_net ps_ctl_interconnect_M03_AXI [get_bd_intf_pins intx_msi_handler_0/S_AXI] [get_bd_intf_pins ctl_interconnect/M03_AXI]
connect_bd_intf_net [get_bd_intf_pins cmt_0/s_axis_from_fw] [get_bd_intf_pins axis_dwidth_converter_0/M_AXIS]
connect_bd_intf_net [get_bd_intf_pins to_ddr_interconnect/S00_AXI] [get_bd_intf_pins ps_cdma_data_interconnect/M02_AXI]
connect_bd_intf_net [get_bd_intf_pins fet_0/m_axi_fet_ctx] [get_bd_intf_pins nvme_ctx_0/s_axi_fet]
connect_bd_intf_net [get_bd_intf_pins fet_0/s_axi_fet] [get_bd_intf_pins to_nvme_interconnect/M00_AXI]
connect_bd_intf_net [get_bd_intf_pins to_ddr_interconnect/M01_AXI] [get_bd_intf_pins ddr4_0/C0_DDR4_S_AXI]
connect_bd_net -net M00_ARESETN_1 [get_bd_pins rst_ddr4_0/interconnect_aresetn] \
  [get_bd_pins to_ddr_interconnect/M00_ARESETN] [get_bd_pins to_ddr_interconnect/M01_ARESETN]
connect_bd_net -net M06_ACLK_1 [get_bd_pins xdma_pcie_ep/axi_aclk] \
  [get_bd_pins intx_msi_handler_0/S_AXI_ACLK] [get_bd_pins to_xdma_interconnect/M00_ACLK] \
  [get_bd_pins to_ctx_interconnect/S01_ACLK] [get_bd_pins to_xdma_interconnect/ACLK] [get_bd_pins ctl_interconnect/M03_ACLK] \
  [get_bd_pins ctl_interconnect/M04_ACLK]
connect_bd_net -net M06_ARESETN_1 [get_bd_pins xdma_pcie_ep/axi_aresetn] \
  [get_bd_pins intx_msi_handler_0/S_AXI_ARESETN] [get_bd_pins to_xdma_interconnect/M00_ARESETN] \
  [get_bd_pins to_ctx_interconnect/S01_ARESETN] [get_bd_pins to_xdma_interconnect/ARESETN] \
  [get_bd_pins ctl_interconnect/M03_ARESETN]
connect_bd_net [get_bd_pins ddr4_0/c0_ddr4_ui_clk] \
  [get_bd_pins rst_ddr4_0/slowest_sync_clk] [get_bd_pins vio_1/clk] [get_bd_pins to_ddr_interconnect/M00_ACLK] \
  [get_bd_pins to_ddr_interconnect/M01_ACLK]
connect_bd_net [get_bd_pins ddr4_0/c0_ddr4_ui_clk_sync_rst] [get_bd_pins rst_ddr4_0/ext_reset_in]
connect_bd_net [get_bd_pins ddr4_0/c0_init_calib_complete] [get_bd_ports c0_init_calib_complete_0] [get_bd_pins vio_1/probe_in0]
connect_bd_net [get_bd_pins intx_msi_handler_0/o_sb_intx_msi_request] [get_bd_pins xdma_pcie_ep/usr_irq_req]
connect_bd_net [get_bd_pins nvme_ctx_0/o_cc_en] [get_bd_pins fet_0/i_cc_en] [get_bd_pins cmt_0/i_cc_en]
connect_bd_net [get_bd_pins nvme_ctx_0/o_cc_mps] [get_bd_pins cmt_0/i_cc_mps] [get_bd_pins fet_0/i_cc_mps]
connect_bd_net [get_bd_pins nvme_ctx_0/o_cont_cntxt_tbl] [get_bd_pins fet_0/i_cont_cntxt_tbl]
connect_bd_net [get_bd_pins nvme_ctx_0/o_flr] [get_bd_pins cmt_0/i_flr] [get_bd_pins fet_0/i_flr]
connect_bd_net [get_bd_pins nvme_ctx_0/o_func_cntxt_tbl] [get_bd_pins fet_0/i_func_cntxt_tbl]
connect_bd_net [get_bd_pins nvme_ctx_0/o_func_rdy] [get_bd_pins fet_0/i_func_rdy]
connect_bd_net [get_bd_pins nvme_ctx_0/o_port_cntxt_tbl] [get_bd_pins fet_0/i_port_cntxt_tbl]
connect_bd_net -net proc_sys_reset_2_peripheral_aresetn [get_bd_pins rst_ps_clk0_125M/interconnect_aresetn] \
  [get_bd_pins to_nvme_interconnect/M00_ARESETN] [get_bd_pins to_nvme_interconnect/M01_ARESETN] \
  [get_bd_pins to_nvme_interconnect/M02_ARESETN] [get_bd_pins to_nvme_interconnect/M03_ARESETN] \
  [get_bd_pins axi_fifo_mm_s_0/s_axi_aresetn] [get_bd_pins axis_dwidth_converter_0/aresetn] \
  [get_bd_pins axis_dwidth_converter_1/aresetn] [get_bd_pins to_ctx_interconnect/ARESETN] \
  [get_bd_pins to_ctx_interconnect/S00_ARESETN] [get_bd_pins to_ctx_interconnect/M00_ARESETN] \
  [get_bd_pins to_xdma_interconnect/S00_ARESETN] [get_bd_pins to_xdma_interconnect/S01_ARESETN] \
  [get_bd_pins to_nvme_interconnect/ARESETN] [get_bd_pins to_nvme_interconnect/S00_ARESETN] \
  [get_bd_pins to_nvme_interconnect/M04_ARESETN] [get_bd_pins ctl_interconnect/M02_ARESETN] \
  [get_bd_pins ctl_interconnect/M01_ARESETN] [get_bd_pins ctl_interconnect/M00_ARESETN] \
  [get_bd_pins ctl_interconnect/S00_ARESETN] [get_bd_pins ctl_interconnect/ARESETN] \
  [get_bd_pins axi_cdma_0/s_axi_lite_aresetn] [get_bd_pins axi_cdma_1/s_axi_lite_aresetn]
connect_bd_net -net rst_ddr4_0_333M_peripheral_aresetn [get_bd_pins rst_ddr4_0/peripheral_aresetn] [get_bd_pins ddr4_0/c0_ddr4_aresetn]
connect_bd_net -net rst_ps_clk1_peripheral_aresetn [get_bd_pins rst_ps_clk0_125M/peripheral_aresetn] \
  [get_bd_pins fet_0/i_rstn] [get_bd_pins cmt_0/i_rstn] [get_bd_pins nvme_ctx_0/i_rstn]
connect_bd_net -net rst_ps_clk2_250M_interconnect_aresetn [get_bd_pins rst_ps_clk1_250M/interconnect_aresetn] \
  [get_bd_pins ps_cdma_data_interconnect/ARESETN] [get_bd_pins ps_cdma_data_interconnect/S00_ARESETN] \
  [get_bd_pins ps_cdma_data_interconnect/S01_ARESETN] [get_bd_pins ps_cdma_data_interconnect/M00_ARESETN] \
  [get_bd_pins to_xdma_interconnect/S02_ARESETN] [get_bd_pins to_ddr_interconnect/ARESETN] \
  [get_bd_pins to_ddr_interconnect/S00_ARESETN] [get_bd_pins ps_cdma_data_interconnect/M01_ARESETN] \
  [get_bd_pins cdma_intc/ARESETN] [get_bd_pins cdma_intc/S00_ARESETN] [get_bd_pins cdma_intc/M00_ARESETN] \
  [get_bd_pins cdma_intc/M01_ARESETN] [get_bd_pins cdma_intc/S01_ARESETN] [get_bd_pins cdma_intc/S02_ARESETN] \
  [get_bd_pins cdma_intc/S03_ARESETN] [get_bd_pins ps_cdma_data_interconnect/M02_ARESETN]
connect_bd_net -net rst_ps_clk2_250M_peripheral_aresetn [get_bd_pins rst_ps_clk1_250M/peripheral_aresetn] [get_bd_pins RW_BUFFER/s_axi_aresetn]
connect_bd_net -net sys_rst_n_0_1 [get_bd_ports sys_rst_n_0] [get_bd_pins xdma_pcie_ep/sys_rst_n]
connect_bd_net [get_bd_pins util_ds_buf1/IBUF_DS_ODIV2] [get_bd_pins xdma_pcie_ep/sys_clk]
connect_bd_net [get_bd_pins util_ds_buf1/IBUF_OUT] [get_bd_pins xdma_pcie_ep/sys_clk_gt]
connect_bd_net [get_bd_pins util_ds_buf_0/IBUF_OUT] [get_bd_pins vio_0/clk]
connect_bd_net [get_bd_pins vio_0/probe_out0] [get_bd_pins ddr4_0/sys_rst]
connect_bd_net -net xdma_2_usr_irq_ack [get_bd_pins xdma_pcie_ep/usr_irq_ack] [get_bd_pins intx_msi_handler_0/i_sb_intx_msi_grant]
connect_bd_net [get_bd_pins zynq_ultra_ps_e_0/pl_clk1] \
  [get_bd_pins rst_ps_clk1_250M/slowest_sync_clk] [get_bd_pins axi_cdma_0/m_axi_aclk] \
  [get_bd_pins ps_cdma_data_interconnect/S00_ACLK] [get_bd_pins ps_cdma_data_interconnect/ACLK] \
  [get_bd_pins ps_cdma_data_interconnect/S01_ACLK] [get_bd_pins ps_cdma_data_interconnect/M00_ACLK] \
  [get_bd_pins RW_BUFFER/s_axi_aclk] [get_bd_pins to_xdma_interconnect/S02_ACLK] [get_bd_pins to_ddr_interconnect/S00_ACLK] \
  [get_bd_pins to_ddr_interconnect/ACLK] [get_bd_pins zynq_ultra_ps_e_0/saxihp0_fpd_aclk] [get_bd_pins cdma_intc/ACLK] \
  [get_bd_pins cdma_intc/S00_ACLK] [get_bd_pins cdma_intc/M00_ACLK] [get_bd_pins cdma_intc/M01_ACLK] \
  [get_bd_pins cdma_intc/S01_ACLK] [get_bd_pins axi_cdma_1/m_axi_aclk] [get_bd_pins cdma_intc/S02_ACLK] \
  [get_bd_pins cdma_intc/S03_ACLK] [get_bd_pins ps_cdma_data_interconnect/M01_ACLK] \
  [get_bd_pins ps_cdma_data_interconnect/M02_ACLK] [get_bd_pins zynq_ultra_ps_e_0/maxihpm1_fpd_aclk]
connect_bd_net [get_bd_pins zynq_ultra_ps_e_0/pl_resetn0] [get_bd_pins rst_ps_clk0_125M/ext_reset_in] [get_bd_pins rst_ps_clk1_250M/ext_reset_in]
connect_bd_net [get_bd_pins zynq_ultra_ps_e_0/pl_clk0] \
  [get_bd_pins ctl_interconnect/ACLK] [get_bd_pins rst_ps_clk0_125M/slowest_sync_clk] \
  [get_bd_pins to_nvme_interconnect/M00_ACLK] [get_bd_pins to_nvme_interconnect/M01_ACLK] \
  [get_bd_pins to_nvme_interconnect/M02_ACLK] [get_bd_pins to_nvme_interconnect/M03_ACLK] \
  [get_bd_pins axi_fifo_mm_s_0/s_axi_aclk] [get_bd_pins axis_dwidth_converter_0/aclk] \
  [get_bd_pins axis_dwidth_converter_1/aclk] [get_bd_pins fet_0/i_clk] [get_bd_pins cmt_0/i_clk] \
  [get_bd_pins nvme_ctx_0/i_clk] [get_bd_pins to_ctx_interconnect/ACLK] [get_bd_pins to_ctx_interconnect/S00_ACLK] \
  [get_bd_pins to_ctx_interconnect/M00_ACLK] [get_bd_pins to_xdma_interconnect/S00_ACLK] \
  [get_bd_pins to_xdma_interconnect/S01_ACLK] [get_bd_pins to_nvme_interconnect/ACLK] \
  [get_bd_pins to_nvme_interconnect/S00_ACLK] [get_bd_pins to_nvme_interconnect/M04_ACLK] \
  [get_bd_pins ctl_interconnect/S00_ACLK] [get_bd_pins ctl_interconnect/M00_ACLK] [get_bd_pins ctl_interconnect/M01_ACLK] \
  [get_bd_pins ctl_interconnect/M02_ACLK] [get_bd_pins axi_cdma_0/s_axi_lite_aclk] [get_bd_pins axi_cdma_1/s_axi_lite_aclk] \
  [get_bd_pins zynq_ultra_ps_e_0/maxihpm0_fpd_aclk]
connect_bd_net [get_bd_pins xdma_pcie_ep/axi_ctl_aresetn] [get_bd_pins ctl_interconnect/M04_ARESETN]

# ---- address map ----
assign_bd_address -offset 0x0000000000000000 -range 2G -target_address_space [get_bd_addr_spaces axi_cdma_0/Data] [get_bd_addr_segs zynq_ultra_ps_e_0/SAXIGP2/HP0_DDR_LOW]
assign_bd_address -offset 0x00000000B0000000 -range 32K -target_address_space [get_bd_addr_spaces axi_cdma_0/Data] [get_bd_addr_segs RW_BUFFER/axi_bram_ctrl_1/S_AXI/Mem0]
assign_bd_address -offset 0x0000005000000000 -range 64G -target_address_space [get_bd_addr_spaces axi_cdma_0/Data] [get_bd_addr_segs ddr4_0/C0_DDR4_MEMORY_MAP/C0_DDR4_ADDRESS_BLOCK]
assign_bd_address -offset 0x0000010000000000 -range 512G -target_address_space [get_bd_addr_spaces axi_cdma_0/Data] [get_bd_addr_segs xdma_pcie_ep/S_AXI_B/BAR0]
assign_bd_address -offset 0x0000000000000000 -range 2G -target_address_space [get_bd_addr_spaces axi_cdma_0/Data_SG] [get_bd_addr_segs zynq_ultra_ps_e_0/SAXIGP2/HP0_DDR_LOW]
assign_bd_address -offset 0x00000000B0000000 -range 32K -target_address_space [get_bd_addr_spaces axi_cdma_0/Data_SG] [get_bd_addr_segs RW_BUFFER/axi_bram_ctrl_1/S_AXI/Mem0]
assign_bd_address -offset 0x0000005000000000 -range 64G -target_address_space [get_bd_addr_spaces axi_cdma_0/Data_SG] [get_bd_addr_segs ddr4_0/C0_DDR4_MEMORY_MAP/C0_DDR4_ADDRESS_BLOCK]
assign_bd_address -offset 0x0000010000000000 -range 512G -target_address_space [get_bd_addr_spaces axi_cdma_0/Data_SG] [get_bd_addr_segs xdma_pcie_ep/S_AXI_B/BAR0]
assign_bd_address -offset 0x0000000000000000 -range 2G -target_address_space [get_bd_addr_spaces axi_cdma_1/Data] [get_bd_addr_segs zynq_ultra_ps_e_0/SAXIGP2/HP0_DDR_LOW]
assign_bd_address -offset 0x00000000B0000000 -range 32K -target_address_space [get_bd_addr_spaces axi_cdma_1/Data] [get_bd_addr_segs RW_BUFFER/axi_bram_ctrl_1/S_AXI/Mem0]
assign_bd_address -offset 0x0000005000000000 -range 64G -target_address_space [get_bd_addr_spaces axi_cdma_1/Data] [get_bd_addr_segs ddr4_0/C0_DDR4_MEMORY_MAP/C0_DDR4_ADDRESS_BLOCK]
assign_bd_address -offset 0x0000010000000000 -range 512G -target_address_space [get_bd_addr_spaces axi_cdma_1/Data] [get_bd_addr_segs xdma_pcie_ep/S_AXI_B/BAR0]
assign_bd_address -offset 0x0000000000000000 -range 2G -target_address_space [get_bd_addr_spaces axi_cdma_1/Data_SG] [get_bd_addr_segs zynq_ultra_ps_e_0/SAXIGP2/HP0_DDR_LOW]
assign_bd_address -offset 0x00000000B0000000 -range 32K -target_address_space [get_bd_addr_spaces axi_cdma_1/Data_SG] [get_bd_addr_segs RW_BUFFER/axi_bram_ctrl_1/S_AXI/Mem0]
assign_bd_address -offset 0x0000005000000000 -range 64G -target_address_space [get_bd_addr_spaces axi_cdma_1/Data_SG] [get_bd_addr_segs ddr4_0/C0_DDR4_MEMORY_MAP/C0_DDR4_ADDRESS_BLOCK]
assign_bd_address -offset 0x0000010000000000 -range 512G -target_address_space [get_bd_addr_spaces axi_cdma_1/Data_SG] [get_bd_addr_segs xdma_pcie_ep/S_AXI_B/BAR0]
assign_bd_address -offset 0x46000000 -range 4M -target_address_space [get_bd_addr_spaces cmt_0/m_axi_ctx] [get_bd_addr_segs nvme_ctx_0/s_axi_cmt/Reg]
assign_bd_address -offset 0x10000000000 -range 512G -target_address_space [get_bd_addr_spaces cmt_0/m_axi_ob] [get_bd_addr_segs xdma_pcie_ep/S_AXI_B/BAR0]
assign_bd_address -offset 0x46000000 -range 4M -target_address_space [get_bd_addr_spaces fet_0/m_axi_fet_ctx] [get_bd_addr_segs nvme_ctx_0/s_axi_fet/Reg]
assign_bd_address -offset 0x10000000000 -range 512G -target_address_space [get_bd_addr_spaces fet_0/m_axi_fet_ob] [get_bd_addr_segs xdma_pcie_ep/S_AXI_B/BAR0]
assign_bd_address -offset 0x00000004C0000000 -range 4M -target_address_space [get_bd_addr_spaces xdma_pcie_ep/M_AXI_B] [get_bd_addr_segs nvme_ctx_0/s_axi_host_cpu/Reg]
assign_bd_address -offset 0x00A0000000 -range 64K -target_address_space [get_bd_addr_spaces zynq_ultra_ps_e_0/Data] [get_bd_addr_segs cmt_0/s_axi_cmt/Reg]
assign_bd_address -offset 0x00A0010000 -range 64K -target_address_space [get_bd_addr_spaces zynq_ultra_ps_e_0/Data] [get_bd_addr_segs fet_0/s_axi_fet/Reg]
assign_bd_address -offset 0x00A0020000 -range 64K -target_address_space [get_bd_addr_spaces zynq_ultra_ps_e_0/Data] [get_bd_addr_segs intx_msi_handler_0/S_AXI/reg0]
assign_bd_address -offset 0x00A0030000 -range 4K -target_address_space [get_bd_addr_spaces zynq_ultra_ps_e_0/Data] [get_bd_addr_segs axi_fifo_mm_s_0/S_AXI/Mem0]
assign_bd_address -offset 0x00A0040000 -range 4K -target_address_space [get_bd_addr_spaces zynq_ultra_ps_e_0/Data] [get_bd_addr_segs axi_cdma_0/S_AXI_LITE/Reg]
assign_bd_address -offset 0x00A0041000 -range 4K -target_address_space [get_bd_addr_spaces zynq_ultra_ps_e_0/Data] [get_bd_addr_segs axi_cdma_1/S_AXI_LITE/Reg]
assign_bd_address -offset 0x00B0000000 -range 32K -target_address_space [get_bd_addr_spaces zynq_ultra_ps_e_0/Data] [get_bd_addr_segs RW_BUFFER/axi_bram_ctrl_1/S_AXI/Mem0]
assign_bd_address -offset 0x0400000000 -range 512M -target_address_space [get_bd_addr_spaces zynq_ultra_ps_e_0/Data] [get_bd_addr_segs xdma_pcie_ep/S_AXI_LITE/CTL0]
assign_bd_address -offset 0x04C0000000 -range 4M -target_address_space [get_bd_addr_spaces zynq_ultra_ps_e_0/Data] [get_bd_addr_segs nvme_ctx_0/s_axi_host_cpu/Reg]
assign_bd_address -offset 0x04C0400000 -range 4M -target_address_space [get_bd_addr_spaces zynq_ultra_ps_e_0/Data] [get_bd_addr_segs nvme_ctx_0/s_axi_ctx_reg/Reg]
assign_bd_address -offset 0x5000000000 -range 64G -target_address_space [get_bd_addr_spaces zynq_ultra_ps_e_0/Data] [get_bd_addr_segs ddr4_0/C0_DDR4_MEMORY_MAP/C0_DDR4_ADDRESS_BLOCK]

validate_bd_design
save_bd_design
